# Altium project PWR_PRJ.PrjPcb
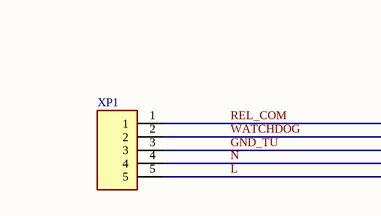
[diagram p0: PWR_SCH.SchDoc, top column 4 of 4]
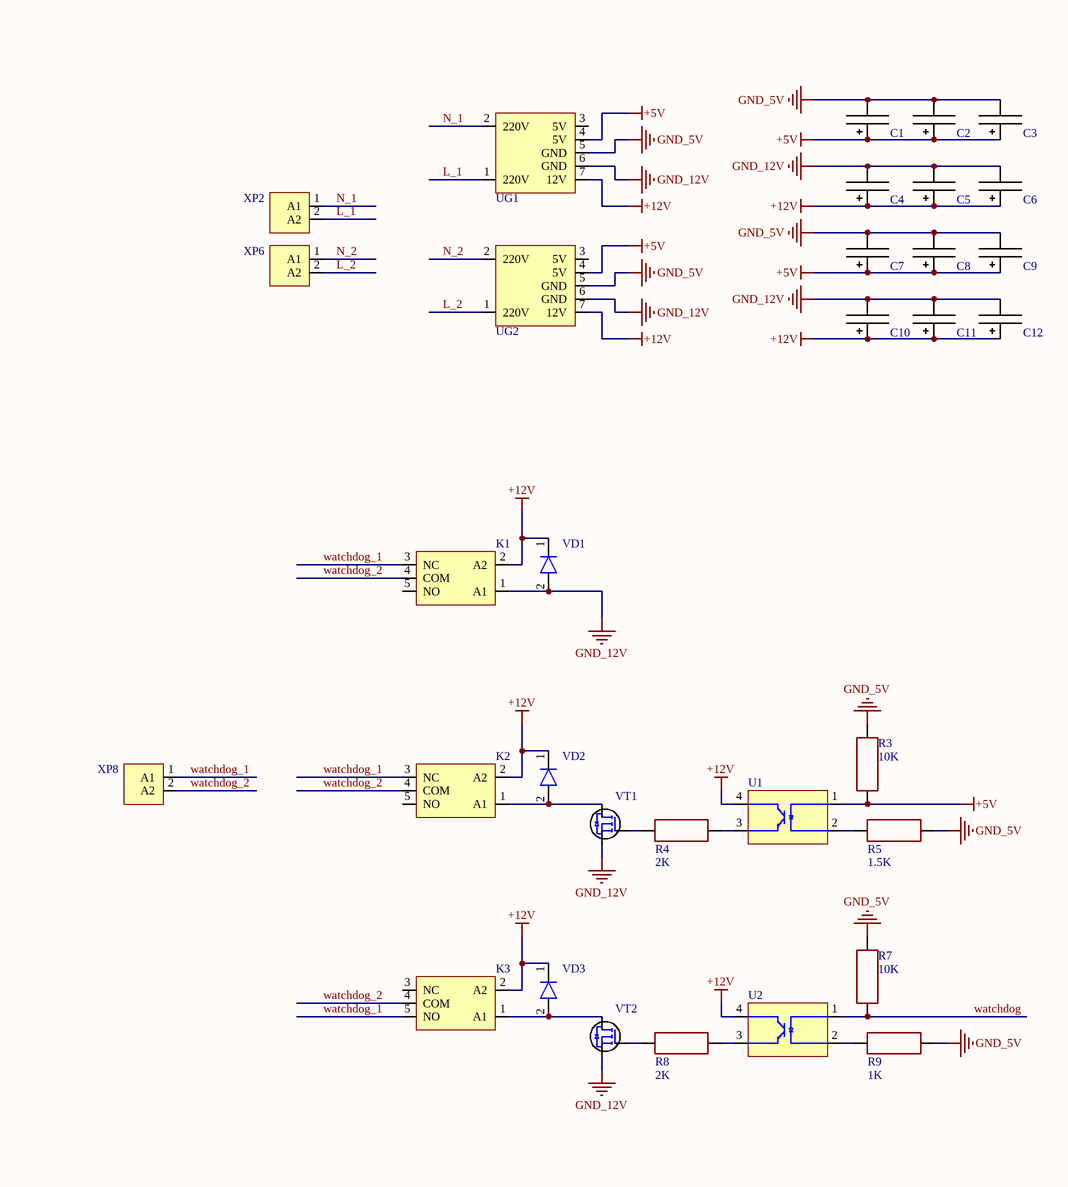
[diagram p1: PWR_SCH.SchDoc, centre column 2 of 4]
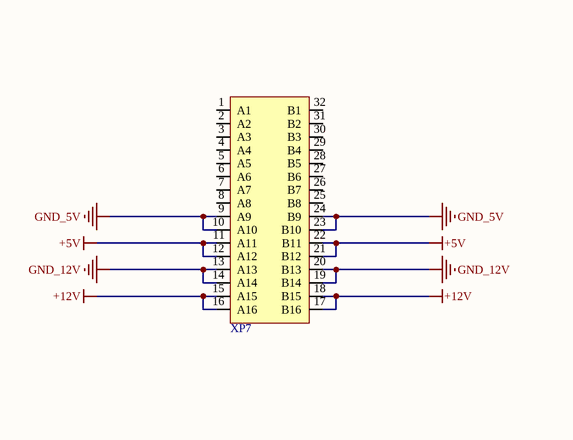
[diagram p2: PWR_SCH.SchDoc, centre column 4 of 4]
1 sheet, 35 parts. Net scope: global (net labels, ports and power ports of the same name join across sheets).
Board file: PWR_PCB.PcbDoc

## Sheet PWR_SCH.SchDoc
size 1651 x 1651 mm

### Parts
C1  CAP_18x20  [CAP 18x20]  (value not drawn)
C2  CAP_18x20  [CAP 18x20]  (value not drawn)
C3  CAP_18x20  [CAP 18x20]  (value not drawn)
C4  CAP_18x20  [CAP 18x20]  (value not drawn)
C5  CAP_18x20  [CAP 18x20]  (value not drawn)
C6  CAP_18x20  [CAP 18x20]  (value not drawn)
C7  CAP_18x20  [CAP 18x20]  (value not drawn)
C8  CAP_18x20  [CAP 18x20]  (value not drawn)
C9  CAP_18x20  [CAP 18x20]  (value not drawn)
C10  CAP_18x20  [CAP 18x20]  (value not drawn)
C11  CAP_18x20  [CAP 18x20]  (value not drawn)
C12  CAP_18x20  [CAP 18x20]  (value not drawn)
K1  RM96-3011-35-1012  [RM96]  (value not drawn)
K2  RM96-3011-35-1012  [RM96]  (value not drawn)
K3  RM96-3011-35-1012  [RM96]  (value not drawn)
R3  value 10K  [RES: 0402]
R4  value 2K  [RES: 0402]
R5  value 1.5K  [RES: 0402]
R7  value 10K  [RES: 0402]
R8  value 2K  [RES: 0402]
R9  value 1K  [RES: 0402]
U1  LTV-357T  [SMD-4]  (value not drawn)
U2  LTV-357T  [SMD-4]  (value not drawn)
UG1  RPD-60A  [RPD-60A]  (value not drawn)
UG2  RPD-60A  [RPD-60A]  (value not drawn)
VD1  1N4148W-7-F  [SOD-123]  (value not drawn)
VD2  1N4148W-7-F  [SOD-123]  (value not drawn)
VD3  1N4148W-7-F  [SOD-123]  (value not drawn)
VT1  2N7002(NX7002AK)  [SOT-23-3]  (value not drawn)
VT2  2N7002(NX7002AK)  [SOT-23-3]  (value not drawn)
XP1  MSTB 2,5 5-GF-5,08  [MSTB 2.5 5-GF-5.08]  (value not drawn)
XP2  MSTB 2,5/2-GF-5,08  [MSTB 2,5/2-GF-5,08]  (value not drawn)
XP6  MSTB 2,5/2-GF-5,08  [MSTB 2,5/2-GF-5,08]  (value not drawn)
XP7  DS1118-32M-R23  [DS1118-32M-R23]  (value not drawn)
XP8  MSTB 2,5/2-GF-5,08  [MSTB 2,5/2-GF-5,08]  (value not drawn)

### Nets
+5V: C1.1 C2.1 C3.1 C7.1 C8.1 C9.1 R3.1 U1.1 UG1.4(5V) UG2.4(5V) XP7.11(A11) XP7.12(A12) XP7.21(B12) XP7.22(B11)
+12V: C4.1 C5.1 C6.1 C10.1 C11.1 C12.1 K1.2(A2) K2.2(A2) K3.2(A2) U1.4 U2.4 UG1.7(12V) UG2.7(12V) VD1.1 VD2.1 VD3.1 XP7.15(A15) XP7.16(A16) XP7.17(B16) XP7.18(B15)
GND_5V: C1.2 C2.2 C3.2 C7.2 C8.2 C9.2 R3.2 R5.2 R7.2 R9.2 UG1.5(GND) UG2.5(GND) XP7.9(A9) XP7.10(A10) XP7.23(B10) XP7.24(B9)
GND_12V: C4.2 C5.2 C6.2 C10.2 C11.2 C12.2 K1.1(A1) UG1.6(GND) UG2.6(GND) VD1.2 VT1.3 VT2.3 XP7.13(A13) XP7.14(A14) XP7.19(B14) XP7.20(B13)
GND_TU: XP1.3
L: XP1.5
L_1: UG1.1(220V) XP2.2(A2)
L_2: UG2.1(220V) XP6.2(A2)
N: XP1.4
N_1: UG1.2(220V) XP2.1(A1)
N_2: UG2.2(220V) XP6.1(A1)
REL_COM: XP1.1
WATCHDOG: R7.1 U2.1 XP1.2
watchdog_1: K1.3(NC) K2.3(NC) K3.5(NO) XP8.1(A1)
watchdog_2: K1.4(COM) K2.4(COM) K3.4(COM) XP8.2(A2)
NetK2_1: K2.1(A1) VD2.2 VT1.2
NetK3_1: K3.1(A1) VD3.2 VT2.2
NetR4_1: R4.1 U1.3
NetR4_2: R4.2 VT1.1
NetR5_1: R5.1 U1.2
NetR8_1: R8.1 U2.3
NetR8_2: R8.2 VT2.1
NetR9_1: R9.1 U2.2

Not connected (* = marked no-connect by the designer): K1 5(NO); K2 5(NO); K3 3(NC); UG1 3(5V); UG2 3(5V); XP7 1(A1) 2(A2) 3(A3) 4(A4) 5(A5) 6(A6) 7(A7) 8(A8) 25(B8) 26(B7) 27(B6) 28(B5) 29(B4) 30(B3) 31(B2) 32(B1)

### Library data of the parts
C1-C12 = CAP_18x20: Aluminium Electrolytic Capacitors; Manufacturer: Vishay; Datasheet: https://www.vishay.com/docs/28499/172rlx.pdf; HelpURL: https://eu.mouser.com/ProductDetail/Vishay/MAL217255472E3?qs=sGAEpiMZZMvwFf0viD3Y3bXvgfG2gej7Mxr0TGrxzpUu%2FFwrHzVi9w%3D%3D; Package/Case: 18x20; Product Category: Aluminium Electrolytic Capacitors
K1-K3 = RM96-3011-35-1012: Relay 12V DC; 8А; 8A/250ВAC;; Manufacturer: Производитель; Datasheet: https://www.tme.eu/Document/00f3bdd8399fa4342821d33e99da3c32/RM96_EN.pdf; HelpURL: https://www.tme.eu/ru/details/rm96-3011-35-1012/rele-elektromagn-miniatiurnye/relpol/; Product Category: Relays
R3-R5 R7-R9 = Resistor_0402: Tolerance: ±5%; Product Category: Resistors; Package/Case: 0402; Temperature: -55...+125°C
U1 U2 = LTV-357T: Transistor Output Optocouplers Optocoupler Phototrans; Manufacturer: Lite-On; Datasheet: https://eu.mouser.com/datasheet/2/239/LTV-357T_series_RevP-1543500.pdf; HelpURL: https://eu.mouser.com/ProductDetail/Lite-On/LTV-357T?qs=IhlP1sn3qi5zhJzi4zUCwQ%3D%3D; Package/Case: SMD-4; Product Category: Optocouplers
UG1 UG2 = RPD-60A: Switching Power Supplies 49W 5V/5A 12V/2A; Manufacturer: MEAN WELL; Datasheet: https://meanwell.by/datasheet/istochniki-pitaniya/pdf-41408.pdf; HelpURL: https://eu.mouser.com/ProductDetail/MEAN-WELL/RPD-60A?qs=V9a8iPeg90yJhi69srjWpw%3D%3D; Product Category: Switching Power Supplies
VD1-VD3 = 1N4148W-7-F: Diodes - General Purpose, Power, Switching SURFACE MOUNT FAST SWITCHING DIODE; Manufacturer: Diodes Incorporated; Datasheet: https://www.diodes.com/assets/Datasheets/BAV16W_1N4148W.pdf; HelpURL: https://eu.mouser.com/ProductDetail/Diodes-Incorporated/1N4148W-7-F?qs=LHX0FizJzg7Ae9ZM8LTAWw%3D%3D; Package/Case: SOD-123; Product Category: Diodes
VT1 VT2 = 2N7002: MOSFET N-CHANNEL 60V 115mA; Manufacturer: Fairchild; Datasheet: https://eu.mouser.com/datasheet/2/308/NDS7002A_D-1522662.pdf; HelpURL: https://eu.mouser.com/ProductDetail/onsemi-Fairchild/2N7002?qs=0dwsXDNhqlz66WJJhrTFjQ%3D%3D; Package/Case: SOT-23; Product Category: MOSFET; Analogue: NX7002AK
XP1 = MSTB 2,5 5-GF-5,08: Value: MSTB 2,5/ 5-GF-5,08; Name: Connector; Help URL: https://www.phoenixcontact.com/online/portal/ru/?uri=pxc-oc-itemdetail:pid=1776537&library=ruru&pcck=P-11-02-11&tab=1&selectedCategory=ALL
XP2 XP6 XP8 = MSTB 2,5/2-GF-5,08_1: Surface Mount, Single row, 2 Positions, 5.08mm; Manufacturer: Phoenix contact; Datasheet: https://www.phoenixcontact.com/ru-pc/produkty/korpusnaa-cast-dla-pecatnyh-plat-mstb-25-2-gf-508-1776508; HelpURL: https://www.phoenixcontact.com/ru-pc/produkty/korpusnaa-cast-dla-pecatnyh-plat-mstb-25-2-gf-508-1776508; Product Category: Connectors
XP7 = DS1118-32M-R23: DIN 41612 Connector; Manufacturer: Connfly; Analogue: HARTING 09221326951(https://eu.mouser.com/ProductDetail/HARTING/09221326951?qs=Afqhj6cPmO9f0oVZo6yWiA%3D%3D); Datasheet: http://en.connfly.group/static/upload/file/pdf/DS1118.pdf; HelpURL: https://www.chipdip.by/product/din41612r-ds1118-32m-r23; Product Category: Connectors